# Altium schematic sheet ChangeLog.SchDoc
size A4; DocumentNumber: 2; SheetNumber: 2; SheetTotal: 2
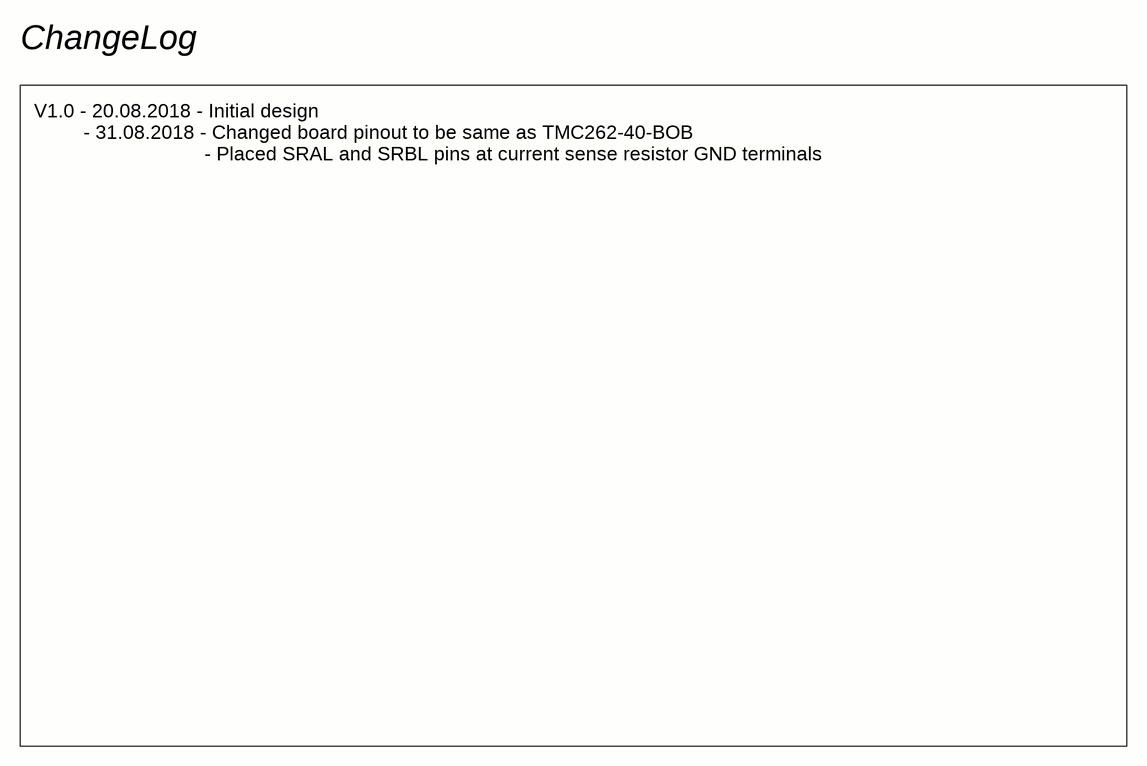
[diagram p0: ChangeLog.SchDoc]

## Notes on the sheet
- ChangeLog
- V1.0 - 20.08.2018 - Initial design
  - 31.08.2018 - Changed board pinout to be same as TMC262-40-BOB
  - Placed SRAL and SRBL pins at current sense resistor GND terminals